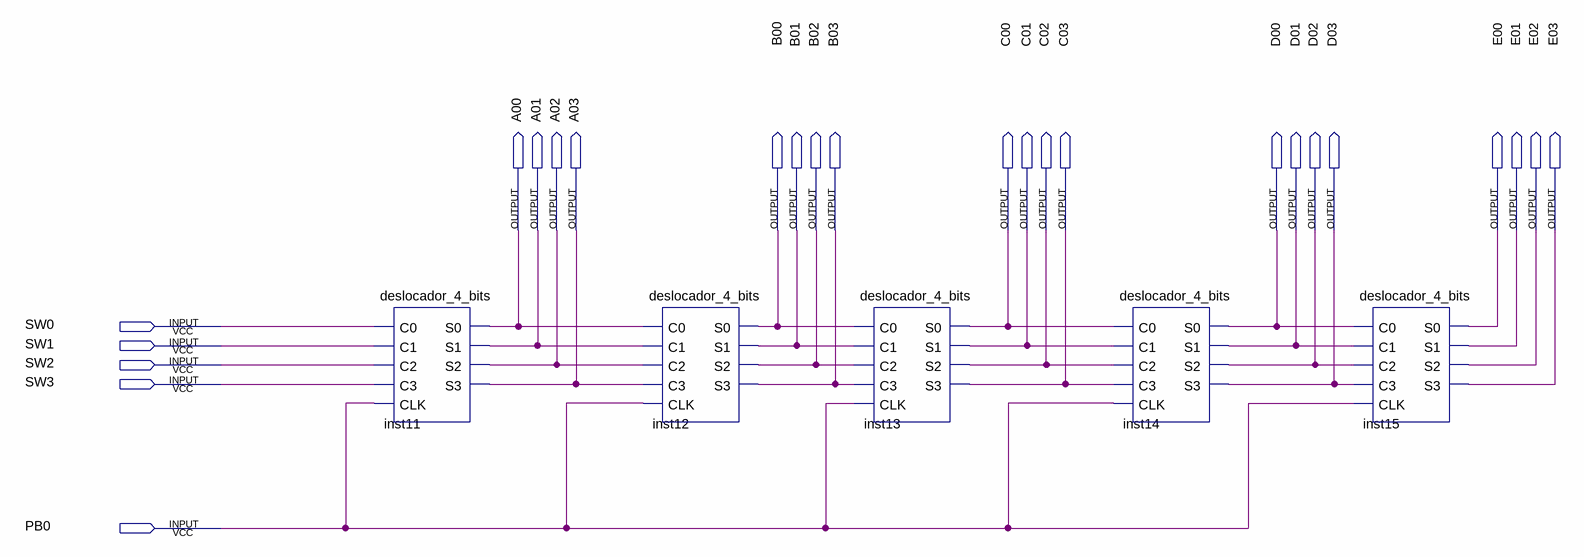
[diagram p0: schematic sheet]
// Quartus schematic seletor_atributo.bdf as structural Verilog: 5 symbols, 25 pins
module seletor_atributo (
  input  SW0,
  input  SW1,
  input  SW2,
  input  SW3,
  input  PB0,
  output A00,
  output A01,
  output A02,
  output A03,
  output B00,
  output B01,
  output B02,
  output B03,
  output C00,
  output C01,
  output C02,
  output C03,
  output D00,
  output D01,
  output D02,
  output D03,
  output E00,
  output E01,
  output E02,
  output E03
);

  deslocador_4_bits inst11 (.C0(SW0), .C1(SW1), .C2(SW2), .C3(SW3), .CLK(PB0), .S0(A00), .S1(A01), .S2(A02), .S3(A03));
  deslocador_4_bits inst12 (.C0(A00), .C1(A01), .C2(A02), .C3(A03), .CLK(PB0), .S0(B00), .S1(B01), .S2(B02), .S3(B03));
  deslocador_4_bits inst13 (.C0(B00), .C1(B01), .C2(B02), .C3(B03), .CLK(PB0), .S0(C00), .S1(C01), .S2(C02), .S3(C03));
  deslocador_4_bits inst14 (.C0(C00), .C1(C01), .C2(C02), .C3(C03), .CLK(PB0), .S0(D00), .S1(D01), .S2(D02), .S3(D03));
  deslocador_4_bits inst15 (.C0(D00), .C1(D01), .C2(D02), .C3(D03), .CLK(PB0), .S0(E00), .S1(E01), .S2(E02), .S3(E03));
endmodule
